# EAGLE design Calunium_v2 (EAGLE 6.2)
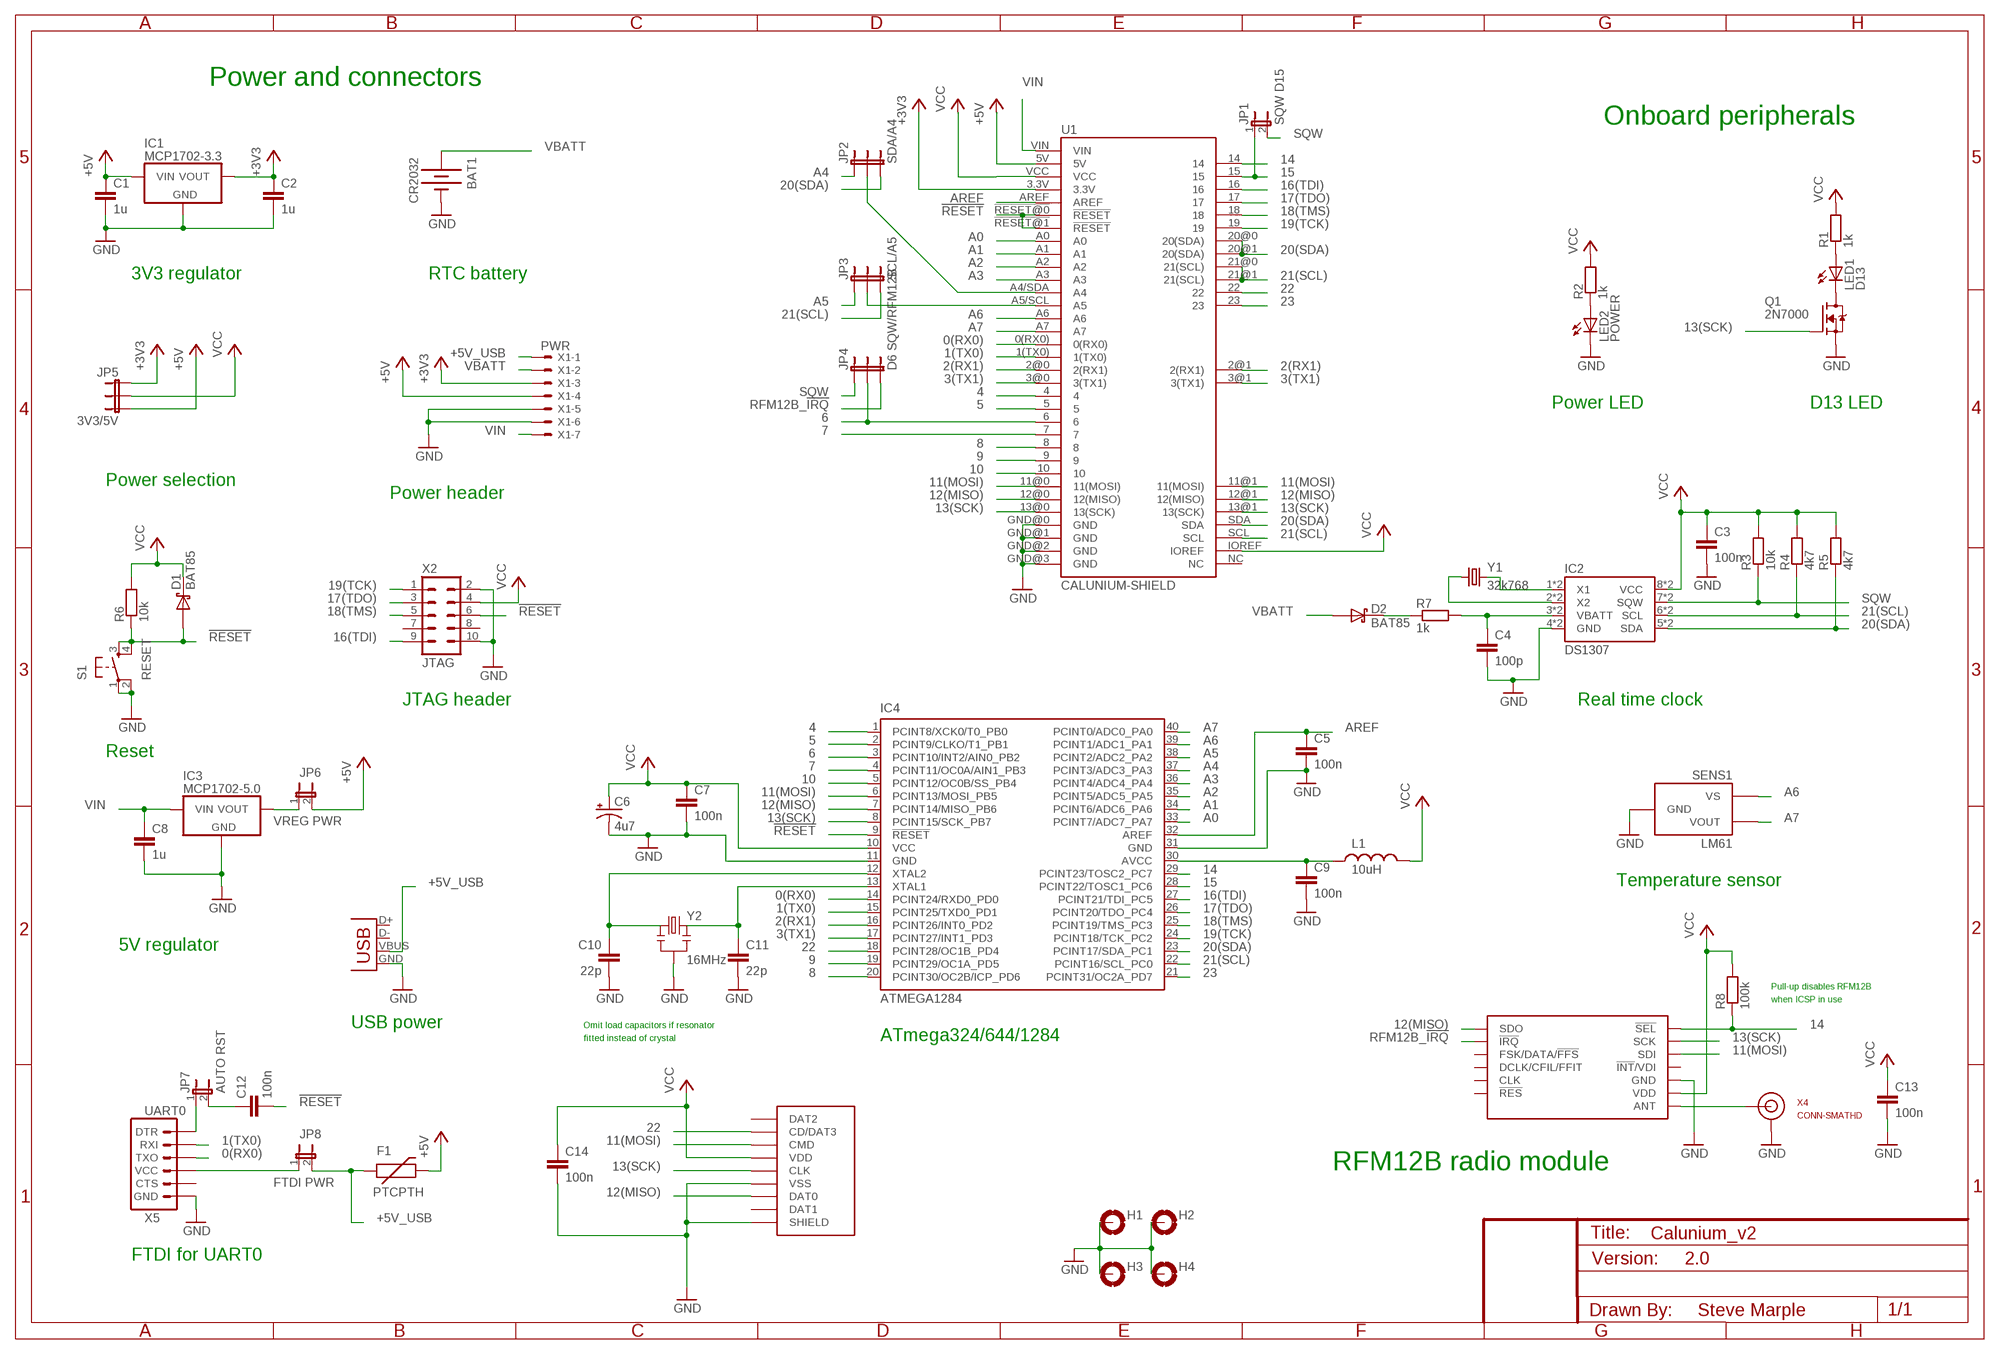
[diagram p0: schematic, sheet 1]

## Parts
BAT1  CR2032  BATTERY20PTH  [BATTCOM_20MM_PTH]
C1  1u  CAPPTH1  [CAP-PTH-5MM]
C2  1u  CAPPTH1  [CAP-PTH-5MM]
C3  100n  CAPPTH  [CAP-PTH-SMALL]
C4  100p  CAPPTH  [CAP-PTH-SMALL]
C5  100n  CAPPTH  [CAP-PTH-SMALL]
C6  4u7  CAP_POLPTH2  [CPOL-RADIAL-10UF-25V]
C7  100n  CAPPTH  [CAP-PTH-SMALL]
C8  1u  CAPPTH1  [CAP-PTH-5MM]
C9  100n  CAPPTH  [CAP-PTH-SMALL]
C10  22p  CAPPTH  [CAP-PTH-SMALL]
C11  22p  CAPPTH  [CAP-PTH-SMALL]
C12  100n  CAPPTH  [CAP-PTH-SMALL]
C13  100n  CAPPTH  [CAP-PTH-SMALL]
C14  100n  CAPPTH  [CAP-PTH-SMALL]
D1  BAT85  DIODE-SCHOTTKY  [DIODE-TH-0.4]
D2  BAT85  DIODE-SCHOTTKY  [DIODE-TH-0.4]
F1  PTCPTH  [PTC]
H1  MOUNT-PAD-ROUND3.0  [3,0-PAD]
H2  MOUNT-PAD-ROUND3.0  [3,0-PAD]
H3  MOUNT-PAD-ROUND3.0  [3,0-PAD]
H4  MOUNT-PAD-ROUND3.0  [3,0-PAD]
IC1  MCP1702-3.3  MCP1702  [TO-92]
IC2  DS1307  DS1307DIL08/SOIC8  [DIL08-SOIC8]
IC3  MCP1702-5.0  MCP1702  [TO-92]
IC4  ATMEGA1284  ATMEGA644-20PU  [DIL40]
JP1  SQW D15  JUMPER-2PTH  [1X02]
JP2  SDA/A4  JUMPER-3PTH  [1X03]
JP3  SCL/A5  JUMPER-3PTH  [1X03]
JP4  D6 SQW/RFM12B  JUMPER-3PTH  [1X03]
JP5  3V3/5V  JUMPER-3PTH  [1X03]
JP6  VREG PWR  JUMPER-2PTH  [1X02]
JP7  AUTO RST  JUMPER-2PTH  [1X02]
JP8  FTDI PWR  JUMPER-2PTH  [1X02]
L1  10uH  INDUCTOR0.4"-AXIAL  [RES-AXIAL-0.4]
LED1  D13  LED3MM  [LED3MM]
LED2  POWER  LED3MM  [LED3MM]
Q1  2N7000  [TO-92]
R1  1k  RESISTOR  [RES-AXIAL-0.4]
R2  1k  RESISTOR  [RES-AXIAL-0.4]
R3  10k  RESISTOR  [RES-AXIAL-0.4]
R4  4k7  RESISTOR  [RES-AXIAL-0.4]
R5  4k7  RESISTOR  [RES-AXIAL-0.4]
R6  10k  RESISTOR  [RES-AXIAL-0.4]
R7  1k  RESISTOR  [RES-AXIAL-0.4]
R8  100k  RESISTOR  [RES-AXIAL-0.4]
RF1  RFM12B  RFM12BSMD  [RFM12B]
S1  RESET  TAC_SWITCHPTH  [TACTILE-PTH]
SENS1  LM61  [TO-92]
U1  CALUNIUM-SHIELD  CALUNIUM-SHIELD-V2NO-OUTLINE-NO-HOLES-NO-TEXT  [CALUNIUM-SHIELD-NO-OUTLINE-NO-HOLES-NO-TEXT-V2]
U$1  MICRO-SD-SOCKETHIROSE-DM3D  [MICRO-SD-SOCKET-HIROSE-DM3D]
X1  PWR  22-23-2071  [22-23-2071]
X2  JTAG  ATMEL-JTAG  [CON-HARTING-ML10]
X3  USB  USBPTH  [USB-B-PTH]
X4  CONN-SMATHD  [SMA-THD]
X5  UART0  ARDUINO_SERIAL_PROGRAMRA_LOCK  [MOLEX-1X6-RA_LOCK]
Y1  32k768  CRYSTALTC38H  [TC38H]
Y2  16MHz  CRYSTAL-RESONATOR  [HC49U-V-RESONATOR]

## Nets
0(RX0): IC4.14(PCINT24/RXD0_PD0) U1.0(RX0) X5.4(TXO)
1(TX0): IC4.15(PCINT25/TXD0_PD1) U1.1(TX0) X5.5(RXI)
2(RX1): IC4.16(PCINT26/INT0_PD2) U1.2@0(2(RX1)) U1.2@1(2(RX1))
3(TX1): IC4.17(PCINT27/INT1_PD3) U1.3@0(3(TX1)) U1.3@1(3(TX1))
4: IC4.1(PCINT8/XCK0/T0_PB0) U1.4
5: IC4.2(PCINT9/CLKO/T1_PB1) U1.5
6: IC4.3(PCINT10/INT2/AIN0_PB2) JP4.2 U1.6
7: IC4.4(PCINT11/OC0A/AIN1_PB3) U1.7
8: IC4.20(PCINT30/OC2B/ICP_PD6) U1.8
9: IC4.19(PCINT29/OC1A_PD5) U1.9
10: IC4.5(PCINT12/OC0B/SS_PB4) U1.10
11(MOSI): IC4.6(PCINT13/MOSI_PB5) RF1.SDI U1.11@0(11(MOSI)) U1.11@1(11(MOSI)) U$1.CMD
12(MISO): IC4.7(PCINT14/MISO_PB6) RF1.SDO U1.12@0(12(MISO)) U1.12@1(12(MISO)) U$1.DAT0
13(SCK): IC4.8(PCINT15/SCK_PB7) Q1.2(G) RF1.SCK U1.13@0(13(SCK)) U1.13@1(13(SCK)) U$1.CLK
14: IC4.29(PCINT23/TOSC2_PC7) R8.P$1 RF1.!SEL U1.14
15: IC4.28(PCINT22/TOSC1_PC6) JP1.1 U1.15
16(TDI): IC4.27(PCINT21/TDI_PC5) U1.16 X2.9(TDI)
17(TDO): IC4.26(PCINT20/TDO_PC4) U1.17 X2.3(TDO)
18(TMS): IC4.25(PCINT19/TMS_PC3) U1.18 X2.5(TMS)
19(TCK): IC4.24(PCINT18/TCK_PC2) U1.19 X2.1(TCK)
20(SDA): IC2.5(SDA) IC2.5@1(SDA) IC4.23(PCINT17/SDA_PC1) JP2.3 R5.P$1 U1.20@0(20(SDA)) U1.20@1(20(SDA)) U1.SDA
21(SCL): IC2.6(SCL) IC2.6@1(SCL) IC4.22(PCINT16/SCL_PC0) JP3.3 R4.P$1 U1.21@0(21(SCL)) U1.21@1(21(SCL)) U1.SCL
22: IC4.18(PCINT28/OC1B_PD4) U1.22 U$1.CD/DAT3
23: IC4.21(PCINT31/OC2A_PD7) U1.23
!RESET: C12.2 D1.A IC4.9(!RESET) R6.P$1 S1.3 S1.4 U1.!RESET@0(!RESET) U1.!RESET@1(!RESET) X2.6(!SRST)
+3V3 [power]: C2.1 IC1.3(VOUT) JP5.1 U1.3.3V X1.3
+5V [power]: C1.1 F1.P$2 IC1.2(VIN) JP5.3 JP6.2 U1.5V X1.4
+5V_USB [power]: F1.P$1 JP8.2 X1.1 X3.VBUS
A0: IC4.33(PCINT7/ADC7_PA7) U1.A0
A1: IC4.34(PCINT6/ADC6_PA6) U1.A1
A2: IC4.35(PCINT5/ADC5_PA5) U1.A2
A3: IC4.36(PCINT4/ADC4_PA4) U1.A3
A4: IC4.37(PCINT3/ADC3_PA3) JP2.1
A5: IC4.38(PCINT2/ADC2_PA2) JP3.1
A6: IC4.39(PCINT1/ADC1_PA1) SENS1.1(VS) U1.A6
A7: IC4.40(PCINT0/ADC0_PA0) SENS1.2(VOUT) U1.A7
AREF: C5.1 IC4.32(AREF) U1.AREF
AVCC [power]: C9.1 IC4.30(AVCC) L1.P$1
GND [power]: BAT1.2(-) C1.2 C2.2 C3.2 C4.2 C5.2 C6.2(-) C7.2 C8.2 C9.2 C10.2 C11.2 C13.2 C14.2 H1.B3,0(MOUNT) H2.B3,0(MOUNT) H3.B3,0(MOUNT) H4.B3,0(MOUNT) IC1.1(GND) IC2.4(GND) IC2.4@1(GND) IC3.1(GND) IC4.11(GND) IC4.31(GND) LED2.K(C) Q1.1(S) RF1.GND@0(GND) RF1.GND@1(GND) S1.1 S1.2 SENS1.3(GND) U1.GND@0(GND) U1.GND@1(GND) U1.GND@2(GND) U1.GND@3(GND) U$1.GND(VSS) U$1.SHIELD@0(SHIELD) X1.5 X1.6 X2.2(GND) X2.10(GND) X3.GND X4.GND@0(GND) X4.GND@1(GND) X4.GND@2(GND) X4.GND@3(GND) X5.1(GND) Y2.GND
N$1: C11.1 IC4.13(XTAL1) Y2.2
N$2: C10.1 IC4.12(XTAL2) Y2.1
N$3: LED1.A R1.P$1
N$4: LED1.K(C) Q1.3(D)
N$5: IC2.1(X1) IC2.1@1(X1) Y1.2
N$6: JP2.2 U1.A4/SDA(A4)
N$8: LED2.A R2.P$1
N$9: D2.C R7.P$1
N$10: JP8.1 X5.3(VCC)
N$11: C4.1 IC2.3(VBATT) IC2.3@1(VBATT) R7.P$2
N$12: IC2.2(X2) IC2.2@1(X2) Y1.1
N$13: JP3.2 U1.A5/SCL(A5)
N$14: IC3.3(VOUT) JP6.1
N$15: JP7.1 X5.6(DTR)
N$16: C12.1 JP7.2
N$17 [antenna]: RF1.ANT X4.SIG(SIGNAL)
RFM12B_!IRQ: JP4.3 RF1.!IRQ
SQW: IC2.7(SQW) IC2.7@1(SQW) JP1.2 JP4.1 R3.P$1
VBATT: BAT1.1(+) D2.A X1.2
VCC [power]: C3.1 C6.1(+) C7.1 C13.1 C14.1 D1.C IC2.8(VCC) IC2.8@1(VCC) IC4.10(VCC) JP5.2 L1.P$2 R1.P$2 R2.P$2 R3.P$2 R4.P$2 R5.P$2 R6.P$2 R8.P$2 RF1.VDD U1.IOREF U1.VCC U$1.VDD X2.4(VTREF)
VIN [power]: C8.1 IC3.2(VIN) U1.VIN X1.7
Unconnected: RF1.!INT!/VDI RF1.!RES RF1.CLK RF1.DCLK/CFIL/FFIT RF1.FSK/DATA/!FFS U1.NC U$1.DAT1 U$1.DAT2 X2.7(NC) X2.8(NC) X3.D+ X3.D- X5.2(CTS)

## Notes on the sheet
- Power and connectors
- Onboard peripherals
- 3V3 regulator | RTC battery
- Power LED | D13 LED
- Power selection
- Power header
- JTAG header | Real time clock
- Reset
- Temperature sensor
- 5V regulator
- Pull-up disables RFM12B
- when ICSP in use
- USB power | Omit load capacitors if resonator
- fitted instead of crystal | ATmega324/644/1284
- RFM12B radio module
- FTDI for UART0 | 2.0
- Steve Marple

## Library data of the parts
BAT1 = SparkFun:BATTERY: Battery Holders Various common sizes : AA, AAA, 20mm coin cell and 12mm coin cell.
C1-C5 C7-C9 C12-C14 = SparkFun:CAP: Capacitor Standard 0603 ceramic capacitor, and 0.1" leaded capacitor.
C6 = SparkFun:CAP_POL: Capacitor Polarized These are standard SMD and PTH capacitors. Normally 10uF, 47uF, and 100uF in electrolytic and tantalum varieties. Always verify the external diameter of the through hole cap, it varies with capacity, voltage, and manufacturer. The EIA devices should be standard.
C10 C11 = SparkFun:CAP: Capacitor Standard 0603 ceramic capacitor, and 0.1" leaded capacitor.; OPTION: Do not fit for ceramic resonator
D1 D2 = SteveMarple:DIODE-SCHOTTKY
F1 = SparkFun:PTC: Resettable Fuse PTC Resettable Fuse. Spark Fun Electronics SKU : COM-08357
H1-H4 = holes:MOUNT-PAD-ROUND: MOUNTING PAD, round
IC1 IC3 = SteveMarple:MCP1702: Microchip MCP1702 250mA loq quiescent current (2uA) LDO voltage regulator.
IC2 = SteveMarple:DS1307
IC4 = SteveMarple:ATMEGA644-*PU: 8-bit Microcontroller with 64K Bytes In-System Programmable Flash Auto generated by make-symbol-device-package-bsdl.ulp Rev. 34 Source: http://www.atmel.com/dyn/resources/prod_documents/doc2593.pdf; MPN: ATMEGA644-20PU; OC_FARNELL: 1288340; OC_NEWARK: 23M5060
JP1 JP6-JP8 = SparkFun:JUMPER-2: Jumper Basic 0.1" spaced jumper. Use with breakaway headers.
JP2-JP5 = SparkFun:JUMPER-3
L1 = SteveMarple:INDUCTOR: Inductors Basic Inductor/Choke - 0603 and 1206. Footprints are not proven and vary greatly between part numbers.
LED1 LED2 = SparkFun:LED: LEDs Standard schematic elements and footprints for 5mm, 3mm, 1206, and 0603 sized LEDs. 5mm - Spark Fun Electronics SKU : COM-00529 (and others)
Q1 = SteveMarple:2N7000: 2N7000 FET
R1-R8 = SteveMarple:RESISTOR: 1/4W PTH resistor
RF1 = SteveMarple:RFM12B: RFM12B radio module by HopeRF
S1 = SparkFun:TAC_SWITCH: Momentary Switch Button commonly used for reset or general input. Spark Fun Electronics SKU : COM-00097
SENS1 = SteveMarple:LM61
U1 = SteveMarple:CALUNIUM-SHIELD-V2
U$1 = SteveMarple:MICRO-SD-SOCKET
X1 = con-molex:22-23-2071: .100" (2.54mm) Center Header - 7 Pin; MF: MOLEX; MPN: 22-23-2071; OC_FARNELL: 1654534; OC_NEWARK: 56H0445
X2 = SteveMarple:ATMEL-JTAG: ATMEL JTAG header
X3 = SteveMarple:USB: USB Connectors USB-B-PTH is fully proven SKU : PRT-00139 USB-miniB is fully proven SKU : PRT-00587 USB-A-PCB is untested. USB-A-H is throughly reviewed, but untested. Spark Fun Electronics SKU : PRT-00437 USB-B-SMT is throughly reviewed, but untested. Needs silkscreen touching up. USB-A-S has not been used/tested USB-MB-H has not been used/tested
X4 = SteveMarple:CONN-SMA: SMA connector
X5 = SparkFun:ARDUINO_SERIAL_PROGRAM
Y1 = SteveMarple:CRYSTAL: Crystals Various standard crystals. Proven footprints. Spark Fun Electronics SKU : COM-00534
Y2 = SteveMarple:CRYSTAL-RESONATOR: Crystal/resonator; OPTION: Crystal or ceramic resonator. Max 12MHz for 3V3 operation.

## Net classes
1 power: width 0.381 mm
3 antenna: width 0.61 mm

## Board
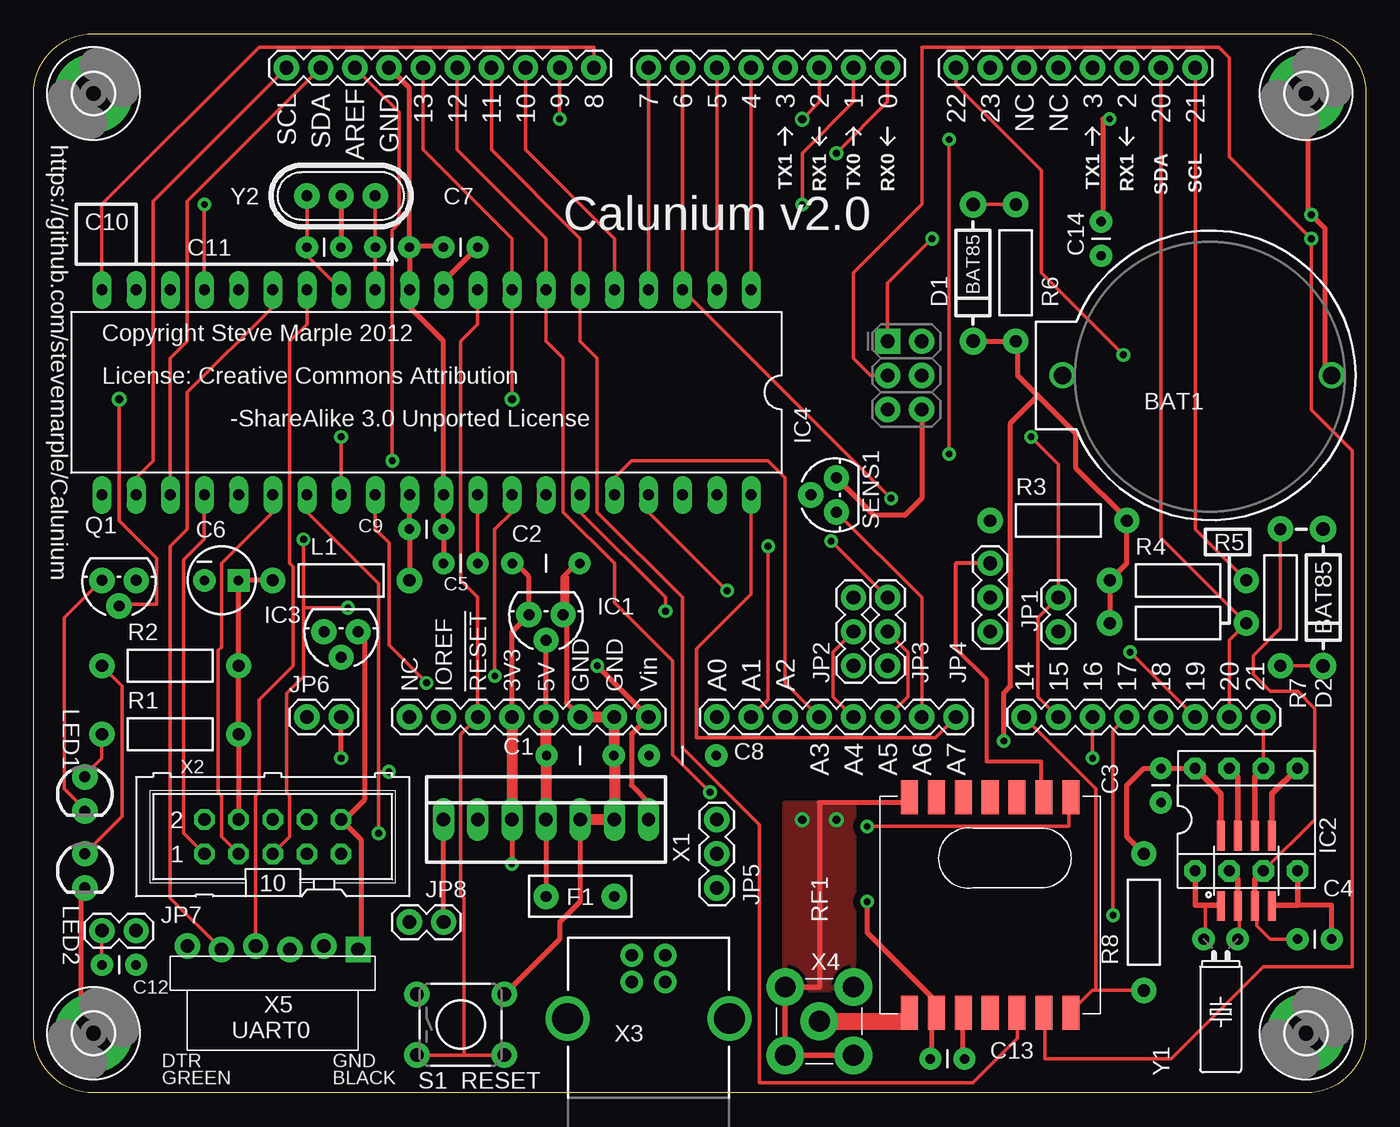
[diagram p1: board, top side]
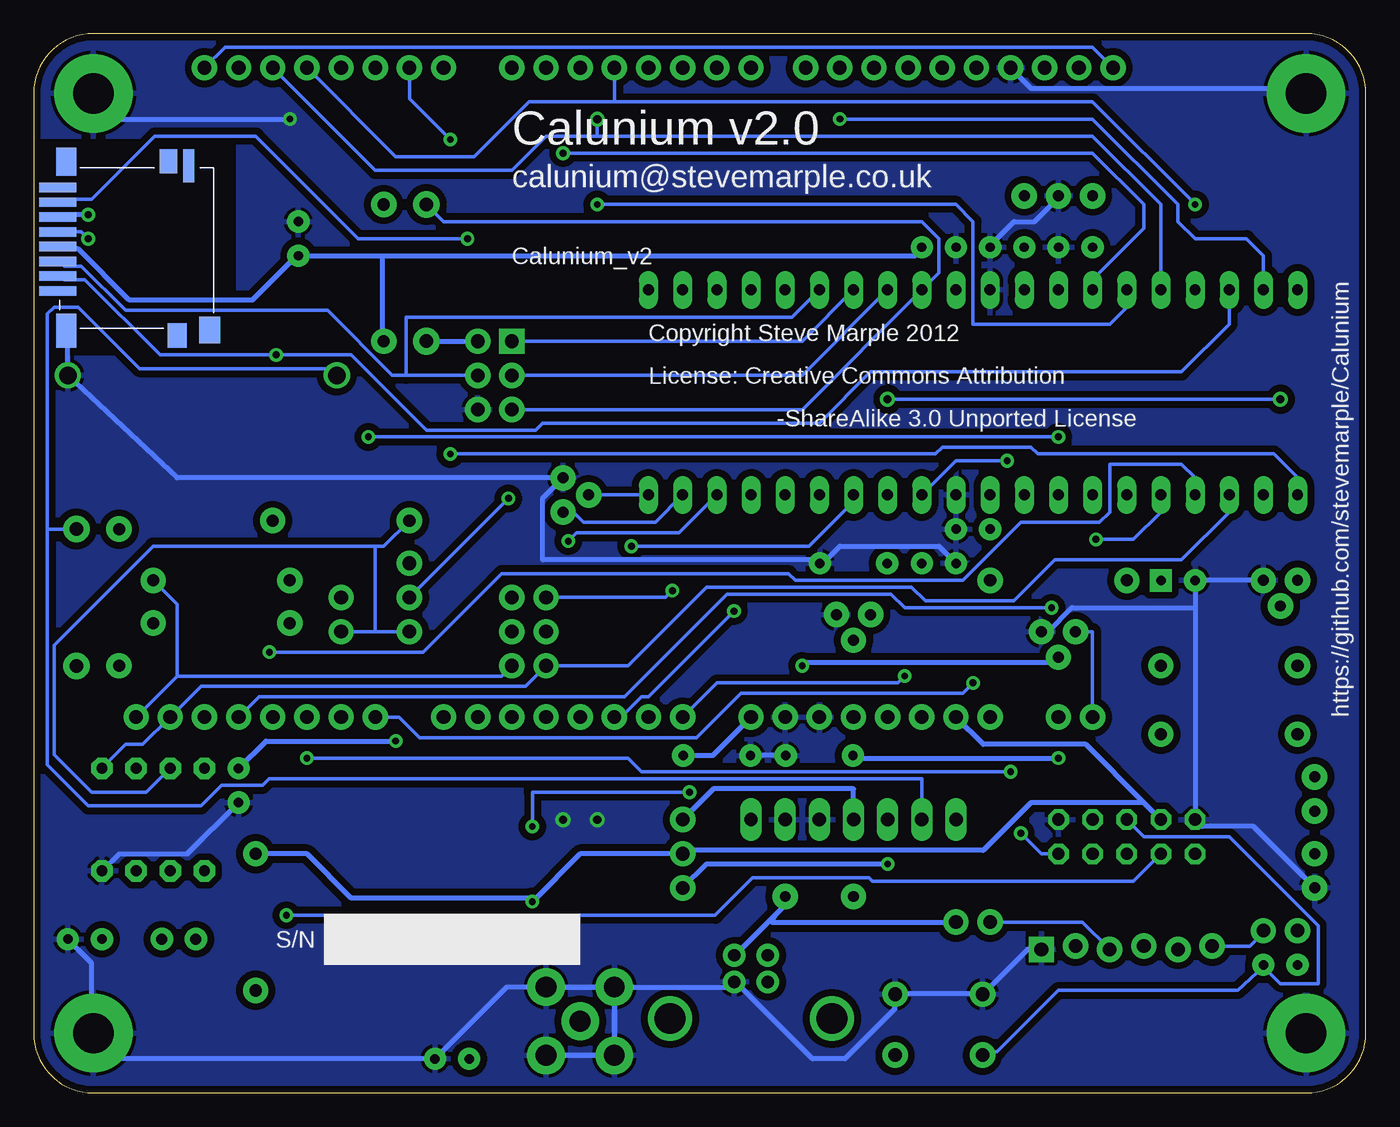
[diagram p2: board, bottom side, seen from below]

Size 99.06 x 78.74 mm. Coordinates in mm from the lower left corner, seen from the top.
Outline: 0,74.3 arc-90 4.45,78.74 94.61,78.74 arc-90 99.06,74.3 99.06,4.45 arc-90 94.61,0 4.45,0 arc-90 0,4.45 0,74.3
Copper layers (1*16): Top 0.035mm / dielectric 1.5mm / Bottom 0.035mm
Design rules: minimum track width 10mil, minimum drill 20mil, track to track 10mil, track to pad 10mil, pad to pad 10mil, via to via 10mil, smd to smd 10mil, copper to edge 10mil, drill to drill 8mil, minimum pad ring 12mil, minimum via ring 10mil, stop-mask expansion 4mil, vias tented up to drill 25mil, thermal gap 10mil
tRestrict: area 64.8,9.5 to 77.5,18.4

### Footprints (pad centres in the part's own frame; a part is rotated, then mirrored left to right if it is on the bottom)
BATTCOM_20MM_PTH = drill 1.3: 1 20,0; 2 0,0
CAP-PTH-5MM = drill 0.7 pad 1.651: 1 -2.5,0; 2 2.5,0
CAP-PTH-SMALL = drill 0.7 pad 1.651: 1 0,0; 2 2.54,0
CPOL-RADIAL-10UF-25V = drill 0.7 pad 1.651 square: 1 1.27,0 | drill 0.7 pad 1.651: 2 -1.27,0
DIODE-TH-0.4 = drill 1 pad 1.981: A -5.08,0; C 5.08,0
PTC = drill 0.8 pad 1.88: P$1 -2.54,0; P$2 2.54,0
3,0-PAD = drill 3 pad 5.842: B3,0 0,0
TO-92 = drill 0.813 pad 1.88: 1 -1.27,0; 2 0,1.905; 3 1.27,0
DIL08-SOIC8 = drill 0.813 pad 1.6 octagon: 1 -3.81,-3.81; 2 -1.27,-3.81; 3 1.27,-3.81; 4 3.81,-3.81; 5 3.81,3.81; 6 1.27,3.81; 7 -1.27,3.81; 8 -3.81,3.81 | smd 0.61 x 2.21: 1@1 -1.905,-6.426; 2@1 -0.635,-6.426; 3@1 0.635,-6.426; 4@1 1.905,-6.426; 5@1 1.905,-1.194; 6@1 0.635,-1.194; 7@1 -0.635,-1.194; 8@1 -1.905,-1.194
DIL40 = drill 0.813 long: 1 -24.13,-7.62; 2 -21.59,-7.62; 3 -19.05,-7.62; 4 -16.51,-7.62; 5 -13.97,-7.62; 6 -11.43,-7.62; 7 -8.89,-7.62; 8 -6.35,-7.62; 9 -3.81,-7.62; 10 -1.27,-7.62; 11 1.27,-7.62; 12 3.81,-7.62; 13 6.35,-7.62; 14 8.89,-7.62; 15 11.43,-7.62; 16 13.97,-7.62; 17 16.51,-7.62; 18 19.05,-7.62; 19 21.59,-7.62; 20 24.13,-7.62; 21 24.13,7.62; 22 21.59,7.62; 23 19.05,7.62; 24 16.51,7.62; 25 13.97,7.62; 26 11.43,7.62; 27 8.89,7.62; 28 6.35,7.62; 29 3.81,7.62; 30 1.27,7.62; 31 -1.27,7.62; 32 -3.81,7.62; 33 -6.35,7.62; 34 -8.89,7.62; 35 -11.43,7.62; 36 -13.97,7.62; 37 -16.51,7.62; 38 -19.05,7.62; 39 -21.59,7.62; 40 -24.13,7.62
1X02 = drill 1.016 pad 1.88: 1 0,0; 2 2.54,0
1X03 = drill 1.016 pad 1.88: 1 0,0; 2 2.54,0; 3 5.08,0
RES-AXIAL-0.4 = drill 0.9 pad 1.88: P$1 -5.08,0; P$2 5.08,0
LED3MM = drill 0.813 pad 1.88: A -1.27,0; K 1.27,0
RFM12B = smd 2.54 x 1.27: !INT!/VDI 8,0; !IRQ -8,4; !RES -8,-4; !SEL 8,6; ANT 8,-6; CLK -8,-2; DCLK/CFIL/FFIT -8,0; FSK/DATA/!FFS -8,2; GND@0 -8,-6; GND@1 8,-2; SCK 8,4; SDI 8,2; SDO -8,6; VDD 8,-4
TACTILE-PTH = drill 1.016 pad 1.88: 1 -3.251,2.261; 2 3.251,2.261; 3 -3.251,-2.261; 4 3.251,-2.261
CALUNIUM-SHIELD-NO-OUTLINE-NO-HOLES-NO-TEXT-V2 = drill 1.016 pad 1.88: 0(RX0) 0,21.59; 1(TX0) -2.54,21.59; 2@0 -5.08,21.59; 2@1 17.78,21.59; 3.3V -27.94,-26.67; 3@0 -7.62,21.59; 3@1 15.24,21.59; 4 -10.16,21.59; 5 -12.7,21.59; 5V -25.4,-26.67; 6 -15.24,21.59; 7 -17.78,21.59; 8 -21.844,21.59; 9 -24.384,21.59; 10 -26.924,21.59; 11@0 -29.464,21.59; 11@1 2.54,-1.27; 12@0 -32.004,21.59; 13@0 -34.544,21.59; 13@1 0,-1.27; 14 10.16,-26.67; 15 12.7,-26.67; 16 15.24,-26.67; 17 17.78,-26.67; 18 20.32,-26.67; 19 22.86,-26.67; 20@0 25.4,-26.67; 20@1 20.32,21.59; 21@0 27.94,-26.67; 21@1 22.86,21.59; 22 5.08,21.59; 23 7.62,21.59; !RESET@0 -30.48,-26.67; !RESET@1 0,-3.81; A0 -12.7,-26.67; A1 -10.16,-26.67; A2 -7.62,-26.67; A3 -5.08,-26.67; A4/SDA -2.54,-26.67; A5/SCL 0,-26.67; A6 2.54,-26.67; A7 5.08,-26.67; AREF -39.624,21.59; GND@0 -22.86,-26.67; GND@1 -20.32,-26.67; GND@2 -37.084,21.59; GND@3 2.54,-3.81; IOREF -33.02,-26.67; NC -35.56,-26.67; NC@0 12.7,21.59; NC@1 10.16,21.59; SCL -44.704,21.59; SDA -42.164,21.59; VCC 2.54,1.27; VIN -17.78,-26.67 | drill 1.016 pad 1.88 square: 12@1 0,1.27
MICRO-SD-SOCKET-HIROSE-DM3D = smd 0.7 x 2.75: CD/DAT3 6.6,-1.375; CLK 3.3,-1.375; CMD 5.5,-1.375; DAT0 1.1,-1.375; DAT1 0,-1.375; DAT2 7.7,-1.375; GND 2.2,-1.375; VDD 4.4,-1.375 | smd 1.8 x 1.3: P$11 -1.95,6.85 | smd 2.45 x 0.8: P$12 -1.625,8.35 | smd 1.8 x 1.4: P$13 11,7.5 | smd 2 x 1.55: P$14 10.6,9.925 | smd 2.5 x 1.5: SHIELD@0 10.65,-0.75 | smd 2.1 x 1.5: SHIELD@1 -1.9,-0.75
22-23-2071 = drill 1 long: 1 -7.62,0; 2 -5.08,0; 3 -2.54,0; 4 0,0; 5 2.54,0; 6 5.08,0; 7 7.62,0
CON-HARTING-ML10 = drill 0.914 octagon: 1 -5.08,-1.27; 2 -5.08,1.27; 3 -2.54,-1.27; 4 -2.54,1.27; 5 0,-1.27; 6 0,1.27; 7 2.54,-1.27; 8 2.54,1.27; 9 5.08,-1.27; 10 5.08,1.27
USB-B-PTH = drill 0.914 pad 1.676: D+ 0,1.25; D- 1.981,1.25; GND 0,-1.25; VBUS 1.981,-1.25 | drill 2.286: S1 -2.718,-6.02; S2 -2.718,6.02
SMA-THD = drill 1.549 pad 2.794: GND@0 -2.54,2.54; GND@1 2.54,2.54; GND@2 2.54,-2.54; GND@3 -2.54,-2.54; SIG 0,0
MOLEX-1X6-RA_LOCK = drill 1.016 pad 1.88 square: 1 0,0.127 | drill 1.016 pad 1.88: 2 2.54,-0.127; 3 5.08,0.127; 4 7.62,-0.127; 5 10.16,0.127; 6 12.7,-0.127
TC38H = drill 0.813 pad 1.676: 1 -1.27,0; 2 1.27,0
HC49U-V-RESONATOR = drill 0.813 pad 1.88: 1 -2.54,0; 2 2.54,0; GND 0,0

### Placement (x,y rotation side)
BAT1  96.52,53.34 180 top
C1  40.64,25.08 0 top
C2  38.1,39.37 0 top
C3  83.82,24.13 270 top
C4  93.98,11.43 0 top
C5  33.02,39.37 180 top
C6  13.97,38.1 0 top
C7  33.02,62.87 180 top
C8  48.26,25.08 180 top
C9  27.94,41.91 0 top
C10  25.4,62.87 0 top
C11  20.32,62.87 0 top
C12  5.08,9.53 0 top
C13  66.67,2.54 0 top
C14  79.38,62.23 90 top
D1  69.85,60.96 270 top
D2  95.89,36.83 270 top
F1  40.64,14.61 180 top
H1  94.61,4.45 0 top
H2  4.45,4.45 0 top
H3  4.45,74.3 0 top
H4  94.61,74.3 0 top
IC1  38.1,35.56 180 top
IC2  90.17,20.32 0 top
IC3  22.86,34.29 180 top
IC4  29.21,52.07 180 top
JP1  76.2,36.83 270 top
JP2  60.96,36.83 270 top
JP3  63.5,36.83 270 top
JP4  71.12,34.29 90 top
JP5  50.8,15.24 90 top
JP6  20.32,27.94 0 top
JP7  7.62,12.06 180 top
JP8  27.94,12.7 0 top
L1  22.86,38.1 180 top
LED1  3.81,22.23 270 top
LED2  3.81,16.51 270 top
Q1  6.35,38.1 180 top
R1  10.16,26.67 0 top
R2  10.16,31.75 0 top
R3  76.2,42.55 0 top
R4  85.09,38.1 180 top
R5  85.09,34.92 180 top
R6  73.03,60.96 270 top
R7  92.71,36.83 90 top
R8  82.55,12.7 90 top
RF1  71.12,13.97 270 top
S1  31.75,5.08 0 top
SENS1  59.69,44.45 90 top
U1  63.5,54.61 0 top
U$1  95.89,67.31 270 bottom
X1  38.1,20.32 0 top
X2  17.78,19.05 0 top
X3  45.72,8.26 90 top
X4  58.42,5.33 0 top
X5  24.13,10.79 180 top
Y1  88.27,11.43 180 top
Y2  22.86,66.67 180 top

### Tracks (layer width: path | path; a pad name or v marks a point on that pad's centre or on a via)
0(RX0)  (via drill 0.51)
  Top 0.254: IC4.14 20.32,57.15 19.05,55.88 19.05,39.37 19.3,39.12 19.3,31.75 16.76,29.21 16.76,22.35 16.51,22.1 X5.4 | v59.69,69.85 63.5,73.66 U1.0(RX0)
  Bottom 0.254: v59.69,69.85 20.32,69.85 16.51,66.04 16.51,64.26 20.32,60.45 IC4.14
1(TX0)  (via drill 0.51)
  Top 0.254: IC4.15 17.78,58.42 11.43,52.07 11.43,41.91 10.16,40.64 10.16,14.48 X5.5 | U1.1(TX0) 60.96,73.66 57.15,69.85 v57.15,66.04
  Bottom 0.254: v57.15,66.04 30.48,66.04 29.21,64.77 29.21,57.15 19.05,57.15 17.78,58.42 IC4.15
2(RX1)  (via drill 0.6)
  Top 0.254: U1.2@0 58.42,73.66 v57.15,72.39
  Bottom 0.254: IC4.16 15.24,66.04 20.32,71.12 57.15,71.12 | 57.15,71.12 60.96,71.12 63.5,68.58 73.66,68.58 U1.2@1 | v57.15,72.39 57.15,71.12
3(TX1)  (via drill 0.51)
  Top 0.254: v12.7,66.04 IC4.17
  Bottom 0.254: v12.7,66.04 20.32,73.66 55.88,73.66 | U1.3@0 55.88,73.66 | U1.3@1 72.14,69.6 66.29,69.6 62.23,73.66 55.88,73.66
4
  Top 0.254: U1.4 IC4.1
5
  Top 0.254: U1.5 IC4.2
6  (via drill 0.51)
  Top 0.254: U1.6 IC4.3 v63.75,44.2
  Bottom 0.254: v63.75,44.2 JP4.2
7
  Top 0.254: U1.7 IC4.4
8
  Top 0.254: IC4.20 5.08,66.04 16.76,77.72 41.66,77.72 U1.8
9  (via drill 0.51)
  Top 0.254: U1.9 v39.12,72.39
  Bottom 0.254: IC4.19 7.62,62.23 8.89,63.5 12.7,63.5 13.97,64.77 13.97,66.04 20.32,72.39 v39.12,72.39
10
  Top 0.254: IC4.5 43.18,63.5 36.58,70.1 U1.10
11(MOSI)
  Top 0.254: RF1.SDI 73.15,5.84 73.15,4.06 69.85,0.76 53.98,0.76 53.98,19.94 48.26,25.65 48.26,36.83 41.91,43.18 41.91,54.61 40.64,55.88 IC4.6 40.64,63.5 34.04,70.1 U1.11@0
  Bottom 0.254: U1.11@1 71.37,53.34 | 71.37,53.34 72.39,53.34 77.22,58.17 92.2,58.17 95.5,61.47 96.77,61.47 97.03,61.72 U$1.CMD | 71.37,53.34 71.37,57.66 42.67,57.66 IC4.6
12(MISO)  (via drill 0.51)
  Top 0.254: v66.8,63.5 63.5,60.2 U1.12@1 | v61.98,19.81 76.96,19.81 76.96,21.84 RF1.SDO | v50.29,22.35 47.5,25.15 47.5,32.13 43.18,36.45 43.18,39.37 39.37,43.18 39.37,54.61 38.1,55.88 IC4.7 38.1,63.5 31.5,70.1 U1.12@0
  Bottom 0.254: v66.8,63.5 74.93,63.5 82.55,71.12 90.04,71.12 94.74,66.42 96.77,66.42 97.03,66.29 U$1.DAT0 | v61.98,19.81 61.98,22.35 v50.29,22.35 | U1.12@1 41.91,55.88 IC4.7
13(SCK)  (via drill 0.51, 0.6)
  Top 0.254: RF1.SCK 75.18,5.84 75.18,2.54 84.58,2.54 91.44,9.4 98.04,9.4 98.04,47.75 95,50.8 v95,63.5 88.9,69.6 88.9,76.96 88.14,77.72 66.04,77.72 66.04,66.04 60.96,60.96 60.96,54.61 62.23,53.34 U1.13@1 | U1.13@0 28.96,70.1 35.56,63.5 IC4.8 v35.56,51.56 | v6.35,51.56 6.35,42.55 9.14,39.75 9.14,36.32 6.35,36.32 Q1.2
  Bottom 0.254: v95,63.5 95.5,64.01 97.03,64.01 U$1.CLK | U1.13@1 41.91,53.34 IC4.8 | v35.56,51.56 v6.35,51.56
14  (via drill 0.51)
  Top 0.254: 78.99,7.62 78.99,22.61 U1.14 | RF1.!SEL 77.22,6.1 78.74,7.62 78.99,7.62 | IC4.29 25.4,41.91 26.42,40.89 26.42,33.27 v29.21,30.48 | R8.P$1 78.99,7.62
  Bottom 0.254: v29.21,30.48 29.97,29.72 46.48,29.72 49.78,26.42 70.36,26.42 71.88,27.94 U1.14
15  (via drill 0.51)
  Top 0.254: v22.86,48.77 IC4.28 | v74.17,48.77 76.2,46.74 JP1.1 74.68,35.31 74.68,29.46 U1.15
  Bottom 0.254: v74.17,48.77 v22.86,48.77
16(TDI)  (via drill 0.51)
  Top 0.254: IC4.27 20.32,43.18 25.65,37.85 25.65,23.88 | v25.65,19.3 25.65,23.88 | v78.74,24.89 U1.16 | 25.65,23.88 v26.42,23.88
  Bottom 0.254: v25.65,19.3 24.13,17.78 X2.9 | v78.74,24.89 54.86,24.89 53.85,23.88 v26.42,23.88
17(TDO)  (via drill 0.51)
  Top 0.254: IC4.26 17.78,43.18 13.97,39.37 13.97,33.15 13.72,32.89 13.72,22.35 13.97,22.1 13.97,19.05 X2.3 | U1.17 80.26,26.92 v80.26,13.21
  Bottom 0.254: v80.26,13.21 48.39,13.21 45.59,16 36.96,16 36.7,15.75 17.27,15.75 X2.3
18(TMS)  (via drill 0.51)
  Top 0.254: 20.07,36.07 20.07,30.99 18.8,29.72 18.8,22.35 19.05,22.1 19.05,19.05 X2.5 | 20.07,36.07 v20.07,41.15 | 20.07,36.07 v23.37,36.07
  Bottom 0.254: IC4.25 15.24,43.18 17.27,41.15 v20.07,41.15 | U1.18 82.3,29.46 55.12,29.46 47.5,37.08 35.31,37.08 34.29,36.07 v23.37,36.07
19(TCK)  (via drill 0.51)
  Top 0.254: IC4.24 12.7,41.15 11.18,39.62 11.18,19.3 X2.1 | v81.53,32.77 U1.19
  Bottom 0.254: v81.53,32.77 70.1,32.77 64.26,38.61 42.93,38.61 42.42,38.1 29.97,38.1 25.65,42.42 19.81,42.42 19.05,43.18 19.05,46.74 13.72,46.74 12.7,45.72 IC4.24
20(SDA)
  Top 0.254: IC4.23 10.16,54.61 11.43,55.88 11.43,66.29 U1.SDA | IC2.5@1 92.2,19.05 92.08,19.05 | U1.20@0 88.9,33.66 R5.P$1 83.82,41.27 U1.20@1
  Bottom 0.254: IC2.5 92.2,25.91 90.93,25.91 U1.20@0 86.61,30.23 62.48,30.23 JP2.3 54.86,31.75 49.02,37.59 33.78,37.59 32.77,36.58 26.16,36.58 23.11,39.62 13.72,39.62 10.16,43.18 IC4.23
21(SCL)
  Top 0.254: IC4.22 7.62,45.72 8.89,46.99 8.89,66.29 U1.SCL | IC2.6@1 90.93,19.05 90.81,19.05 | U1.21@0 IC2.6 | U1.21@1 86.36,41.91 R4.P$1
  Bottom 0.254: JP3.3 64.26,30.99 88.39,30.99 | U1.21@0 88.39,30.99 | 88.39,30.99 88.39,36.32 R4.P$1 | U1.SCL 20.32,77.72 84.84,77.72 U1.21@1
22  (via drill 0.51)
  Top 0.254: v81.03,54.86 74.93,60.96 74.93,68.58 68.58,74.93 U1.22
  Bottom 0.254: U$1.CD/DAT3 97.03,60.71 96.77,60.45 95.25,60.45 89.66,54.86 v81.03,54.86 75.44,54.86 69.85,49.28 61.72,49.28 61.21,49.78 40.64,49.78 36.83,53.59 13.72,53.59 10.16,57.15 IC4.18
23  (via drill 0.51)
  Top 0.254: v68.07,70.87 v68.07,47.5
  Bottom 0.254: IC4.21 5.08,45.72 6.86,47.5 24.38,47.5 24.89,48.01 31.5,48.01 32,47.5 v68.07,47.5 | U1.23 71.12,73.91 v68.07,70.87
!RESET
  Top 0.254: 32,2.79 34.8,2.79 S1.4 | 32,2.79 28.7,2.79 S1.3 | 32,2.79 32,14.48 31.75,14.73 31.75,26.67 U1.!RESET@0 33.02,36.83 31.75,38.1 31.75,55.88 33.02,57.15 IC4.9 | D1.A R6.P$1
  Bottom 0.254: X2.6 16.51,19.05 10.16,19.05 3.56,12.45 3.56,8.13 6.35,8.13 7.62,9.4 | 7.62,9.4 9.53,7.62 22.86,7.62 27.43,3.05 28.45,3.05 S1.3 | 7.62,9.4 C12.2 | U1.!RESET@1 41.91,50.8 IC4.9 31.75,60.96 31.75,63.5 33.02,64.77 68.58,64.77 D1.A
+3V3  (via drill 0.51)
  Top 0.381: C2.1 35.81,39.37 36.83,38.35 IC1.3 35.56,34.29 U1.3.3V | X1.3 v35.56,17.02
  Top 0.813: U1.3.3V X1.3
  Bottom 0.381: JP5.1 49.02,17.02 v35.56,17.02
+5V  (via drill 0.51)
  Top 0.381: 38.1,24.89 C1.1 38.1,25.15 | v22.86,24.89 JP6.2 | X1.4 F1.P$2 | U1.5V IC1.2
  Top 0.813: 38.1,24.89 X1.4 | 38.1,25.15 U1.5V
  Bottom 0.381: v22.86,24.89 38.1,24.89 C1.1 | JP5.3 48.51,22.61 38.1,22.61 X1.4
+5V_USB
  Top 0.381: JP8.2 X1.1
  Bottom 0.381: 43.81,13.34 43.18,13.97 F1.P$1 | 43.81,13.34 46.74,10.41 X3.VBUS | JP8.2 44.2,12.7 43.81,13.34
A0  (via drill 0.51)
  Top 0.254: IC4.33 35.56,43.18 34.29,41.91 v34.29,30.99
  Bottom 0.254: v34.29,30.99 34.8,30.48 48.26,30.48 U1.A0
A1  (via drill 0.51)
  Top 0.254: v54.61,40.64 54.61,29.21 U1.A1
  Bottom 0.254: IC4.34 38.1,43.94 41.4,40.64 v54.61,40.64
A2  (via drill 0.51)
  Top 0.254: IC4.35 40.64,43.18 46.99,36.83 v46.99,35.81
  Bottom 0.254: v46.99,35.81 53.34,29.46 53.85,29.46 55.37,27.94 U1.A2
A3
  Top 0.254: IC4.36 43.18,45.72 44.45,46.99 54.61,46.99 55.88,45.72 55.88,30.48 U1.A3
A4  (via drill 0.51)
  Top 0.254: v51.56,37.34 45.72,43.18 IC4.37
  Bottom 0.254: v51.56,37.34 52.07,36.83 JP2.1
A5  (via drill 0.51)
  Top 0.254: JP3.1 v59.31,41.02
  Bottom 0.254: IC4.38 51.05,41.66 58.67,41.66 v59.31,41.02
A6
  Top 0.254: U1.A6 66.04,36.83 SENS1.1
  Bottom 0.254: IC4.39 52.83,42.42 58.17,42.42 58.93,43.18 SENS1.1
A7
  Top 0.254: U1.A7 67.06,26.42 49.28,26.42 49.28,33.02 53.34,37.08 IC4.40
  Bottom 0.254: SENS1.2 IC4.40
AREF  (via drill 0.51)
  Top 0.254: C5.1 IC4.32 | U1.AREF 27.18,72.9 27.18,64.64 26.67,64.14 v26.67,46.99
  Bottom 0.254: v26.67,46.99 30.48,46.99 IC4.32
AVCC
  Top 0.381: IC4.30 C9.1 L1.P$1
GND  (via drill 0.51, 0.6)
  Top 0.381: IC2.4@1 92.2,13.97 92.08,13.97 96.52,13.97 C4.2 | 69.09,6.1 RF1.GND@1 69.09,5.84 69.09,2.54 C13.2 | 65.02,22.1 RF1.GND@0 65.02,21.59 58.42,21.59 58.42,7.87 | LED2.K 3.56,14.99 3.56,5.33 H2.B3,0 | X5.1 24.38,10.92 24.38,18.8 X2.10 23.11,20.32 24.64,21.84 24.64,33.78 IC3.1 | H4.B3,0 94.74,74.17 94.74,65.53 v95,65.28 96.01,64.26 96.01,53.85 BAT1.2 | v80.01,72.39 79.5,72.39 79.5,64.77 C14.2 | Y2.GND C11.2 | 27.94,62.99 30.48,62.99 C7.2 | U1.GND@2 27.94,74.68 27.94,62.99 | 27.94,62.99 C10.2 IC4.11 27.94,58.42 30.48,55.88 IC4.31 C9.2 C5.2 | 43.18,24.89 C1.2 43.18,25.15 | SENS1.3 62.48,42.93 64.77,42.93 66.04,44.2 U1.GND@3 | 39.5,38.48 39.37,38.35 IC1.1 | 39.5,38.48 40.39,39.37 C2.2 | U1.GND@0 39.62,28.96 39.62,38.35 39.5,38.48 | X1.5 40.64,14.22 39.12,12.7 39.12,11.43 35.05,7.37 S1.2
  Top 0.406: 58.42,7.87 X4.GND@0 X4.GND@3 X4.GND@2
  Top 0.813: U1.GND@0 U1.GND@1 43.18,25.15 | X1.5 X1.6 43.18,24.89
  Bottom 0.381: C3.2 87.63,17.78 92.71,17.78 IC2.4 | C4.2 94.74,9.65 94.74,4.57 H1.B3,0 92.71,2.54 C13.2 63.88,7.87 X4.GND@1 | X4.GND@0 47.24,7.87 46.99,8.13 X3.GND 46.74,8.13 41.15,2.54 38.73,2.54 35.05,6.22 35.05,6.48 S1.2 34.8,7.37 28.7,7.37 S1.1 28.45,7.37 25.15,10.67 X5.1 | LED2.K 8.38,19.81 12.19,19.81 X2.2 12.7,36.07 | Q1.1 C6.2 12.7,36.07 | 12.7,36.07 21.84,36.07 23.62,34.29 IC3.1 | U$1.SHIELD@0 96.52,56.64 BAT1.2 88.39,45.72 SENS1.3 61.21,44.2 61.21,39.62 40.39,39.62 C2.2 40.39,39.37 39.12,40.64 31.75,40.64 C5.2 | v95,65.28 97.03,65.28 U$1.GND | v80.01,72.39 92.71,72.39 H4.B3,0 | Y2.GND 22.86,66.55 24.64,64.77 26.16,64.77 27.94,62.99 C10.2 | C1.2 43.18,25.15 45.72,25.15 C8.2 | H3.B3,0 4.83,74.68 24.89,74.68 U1.GND@2
  Bottom 0.406: X4.GND@1 X4.GND@0 X4.GND@3 X4.GND@2
  other vias: 59.69,20.32 57.15,20.32
  pour Bottom (isolate 0.508): -1.27,-1.27 -1.27,80.01 100.33,80.01 100.33,71.12 83.82,71.12 83.82,54.61 100.33,54.61 100.33,-1.27
  pour Top (isolate 0.508): 55.88,7.62 55.88,21.59 60.96,21.59 60.96,7.62
N$1
  Top 0.254: IC4.13 20.32,62.23 C11.1 Y2.2
N$2
  Top 0.254: IC4.12 C10.1 Y2.1
N$3
  Top 0.254: R1.P$1 5.08,24.89 3.81,23.62 LED1.A
N$4
  Top 0.254: Q1.3 2.29,35.31 2.29,22.61 3.81,21.08 LED1.K
N$5
  Top 0.254: IC2.1@1 88.39,13.97 87.12,13.97 | 87.12,13.97 87.12,11.43 Y1.2 | 87.12,13.97 86.36,13.97
N$6
  Top 0.254: U1.A4/SDA 59.44,29.46 59.44,32.77 JP2.2
N$8
  Top 0.254: LED2.A 6.6,20.57 6.6,30.23 R2.P$1
N$9
  Top 0.254: D2.C R7.P$1
N$10
  Bottom 0.254: X5.3 21.08,12.7 JP8.1
N$11
  Top 0.254: 90.81,13.97 90.93,13.97 IC2.3@1 90.93,13.72 90.93,12.45 91.95,11.43 C4.1 | IC2.3 95.25,20.32 95.25,28.57 93.98,29.84 91.95,29.84 90.68,31.11 90.68,32.51 92.71,34.54 R7.P$2
N$12
  Top 0.254: 89.53,13.97 89.66,13.97 IC2.2@1 89.66,13.72 89.66,11.43 Y1.1
N$13
  Top 0.254: U1.A5/SCL 65.02,29.46 65.02,32.77 JP3.2
N$14
  Bottom 0.254: JP6.1 20.32,34.29 IC3.3
N$15
  Bottom 0.254: X5.6 8.64,10.92 7.62,11.94 JP7.1
N$16
  Top 0.254: JP7.2 C12.1
N$17
  Top 0.61: 65.12,5.33 RF1.ANT
  Top 1.27: X4.SIG 65.12,5.33
RFM12B_!IRQ
  Top 0.305: RF1.!IRQ 74.93,21.97 74.93,24.64 70.87,24.64 70.87,30.73 68.58,33.02 68.58,39.37 JP4.3
SQW
  Top 0.254: IC2.7@1 89.66,19.05 89.53,19.05
  Bottom 0.254: JP1.2 73.66,34.29 | 73.66,34.29 JP4.1 | IC2.7 90.68,22.35 94.74,22.35 97.54,25.15 97.54,33.27 90.17,40.64 73.66,40.64 | R3.P$1 73.03,40.64 73.66,40.64 | 73.66,40.64 73.66,34.29
VBATT
  Bottom 0.254: X1.2 33.02,23.37 81.53,23.37 82.04,22.86 85.09,22.86 86.61,21.34 95,21.34 98.04,24.38 98.04,41.91 | 98.04,41.91 98.04,57.91 97.54,58.42 95.76,58.42 91.19,53.85 77.22,53.85 76.71,53.34 BAT1.1 | D2.A 98.04,41.91
VCC  (via drill 0.51)
  Top 0.381: R5.P$2 R4.P$2 81.28,39.37 R3.P$2 81.28,42.67 77.47,46.48 77.47,49.02 74.68,51.82 | D1.C R6.P$2 73.15,55.88 73.15,53.34 74.68,51.82 | C7.1 30.48,60.33 IC4.10 | IC2.8@1 88.39,19.05 88.27,19.05 | IC2.8 C3.1 82.55,24.13 81.28,22.86 81.28,19.05 R8.P$2 | L1.P$2 C6.1 R2.P$2 R1.P$2 X2.4 | C13.1 66.8,2.54 66.8,5.59 67.06,5.84 RF1.VDD 67.06,6.1 67.06,6.86 61.98,11.94 v61.98,14.22 | 74.68,51.82 72.64,49.78 72.64,30.23 72.14,29.72 v72.14,26.16
  Bottom 0.381: D1.C U1.VCC | U$1.VDD 97.03,62.74 95.76,62.74 91.95,58.93 82.8,58.93 79.5,62.23 C14.1 73.15,62.23 | 73.15,62.23 33.53,62.23 33.02,62.74 C7.1 | 73.15,62.23 73.15,55.88 R6.P$2 | 16.51,21.59 24.89,21.59 28.45,18.03 50.55,18.03 JP5.2 58.42,17.78 v61.98,14.22 61.98,14.48 75.44,14.48 78.74,17.78 R8.P$2 | X2.4 16.51,21.59 | U1.IOREF 28.45,25.91 20.83,25.91 16.51,21.59 | v72.14,26.16 81.79,26.16 C3.1
VIN  (via drill 0.51)
  Top 0.381: X1.7 45.72,21.59 44.45,22.86 44.45,26.67 U1.VIN v41.91,31.75
  Bottom 0.381: U1.VIN 48.58,25.08 C8.1 | v41.91,31.75 41.66,32 23.11,32 22.86,32.26 IC3.2

### Text on the board
tPlace: TX1 | RX1 | TX0 | RX0 | TX1 | RX1 | SDA | SCL
tNames: DTR | GND | GREEN | BLACK | RESET
bNames: S/N
tValues: MHz
_tsilk: AREF | SCL | SDA | GND | 13 | 12 | 11 | 10 | 9 | 8 | 7 | 6 | 5 | 4 | 3 | 2 | 1 | 0 | 22 | 23 | NC | NC | 3 | 2 | 20 | 21 | https://github.com/stevemarple/Calunium | Calunium v2.0 | Copyright Steve Marple 2012 | License: Creative Commons Attribution | -ShareAlike 3.0 Unported License | NC | IOREF | !RESET | 3V3 | 5V | GND | GND | Vin | A0 | A1 | A2 | 14 | 15 | 16 | 17 | 18 | 19 | 20 | 21 | A3 | A4 | A5 | A6 | A7
_bsilk: Calunium v2.0 | calunium@stevemarple.co.uk | Copyright Steve Marple 2012 | License: Creative Commons Attribution | -ShareAlike 3.0 Unported License | https://github.com/stevemarple/Calunium